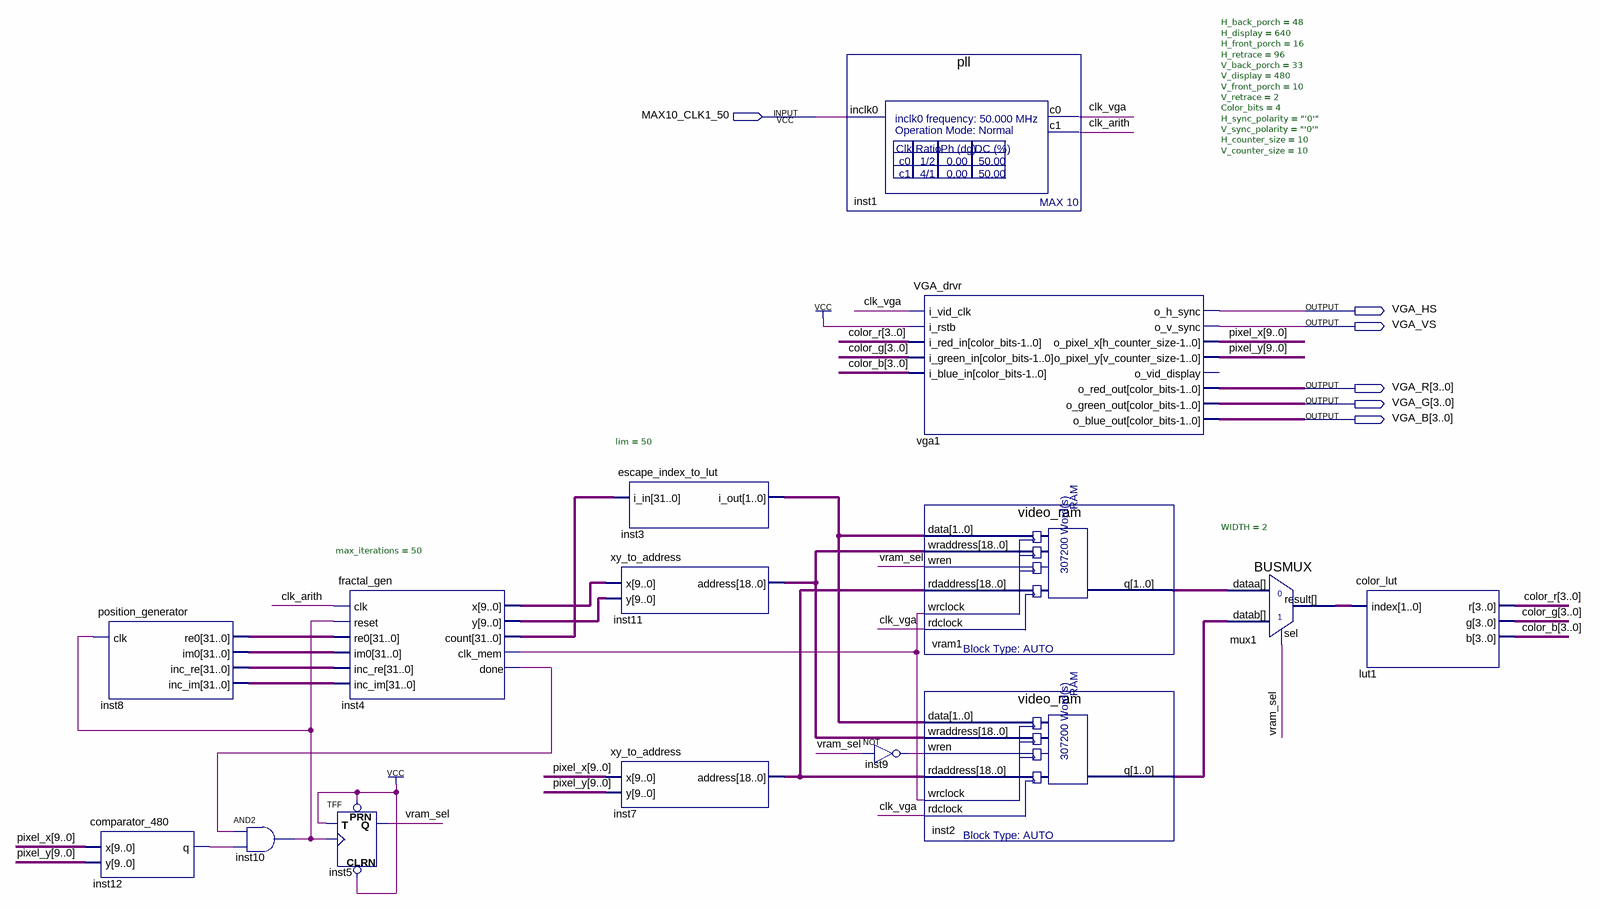
[diagram p0: schematic sheet]
// Quartus schematic fractal.bdf as structural Verilog: 15 symbols, 6 pins
module fractal (
  input  MAX10_CLK1_50,
  output VGA_HS,
  output VGA_VS,
  output [3:0] VGA_R,
  output [3:0] VGA_G,
  output [3:0] VGA_B
);

  wire clk_arith, clk_vga, inst4_clk_mem, inst4_done, inst9_out, inst10_out, inst12_q, vram_sel;
  wire [1:0] inst2_q, inst3_i_out, mux1_result, vram1_q;
  wire [3:0] color_b, color_g, color_r;
  wire [9:0] inst4_x, inst4_y, pixel_x, pixel_y;
  wire [18:0] inst7_address, inst11_address;
  wire [31:0] inst4_count, inst8_im0, inst8_inc_im, inst8_inc_re, inst8_re0;

  position_generator inst8 (
    .clk(inst10_out), .re0(inst8_re0), .im0(inst8_im0), .inc_re(inst8_inc_re), .inc_im(inst8_inc_im));
  comparator_480 inst12 (.x(pixel_x), .y(pixel_y), .q(inst12_q));
  and inst10 (inst10_out, inst4_done, inst12_q);
  fractal_gen #(.max_iterations(50)) inst4 (
    .clk(clk_arith), .reset(inst10_out), .re0(inst8_re0), .im0(inst8_im0), .inc_re(inst8_inc_re),
    .inc_im(inst8_inc_im), .x(inst4_x), .y(inst4_y), .count(inst4_count), .clk_mem(inst4_clk_mem),
    .done(inst4_done));
  TFF inst5 (.PRN(1'b1), .CLRN(1'b1), .T(1'b1), .CLK(inst10_out), .Q(vram_sel));
  escape_index_to_lut #(.lim(50)) inst3 (.i_in(inst4_count), .i_out(inst3_i_out));
  xy_to_address inst11 (.x(inst4_x), .y(inst4_y), .address(inst11_address));
  xy_to_address inst7 (.x(pixel_x), .y(pixel_y), .address(inst7_address));
  pll inst1 (.inclk0(MAX10_CLK1_50), .c0(clk_vga), .c1(clk_arith));
  not inst9 (inst9_out, vram_sel);
  VGA_drvr #(.H_back_porch(48), .H_display(640), .H_front_porch(16), .H_retrace(96), .V_back_porch(33), .V_display(480), .V_front_porch(10), .V_retrace(2), .Color_bits(4), .H_sync_polarity("'0'"), .V_sync_polarity("'0'"), .H_counter_size(10), .V_counter_size(10)) vga1 (
    .i_vid_clk(clk_vga), .i_rstb(1'b1), .i_red_in(color_r), .i_green_in(color_g), .i_blue_in(color_b),
    .o_h_sync(VGA_HS), .o_v_sync(VGA_VS), .o_pixel_x(pixel_x), .o_pixel_y(pixel_y), .o_red_out(VGA_R),
    .o_green_out(VGA_G), .o_blue_out(VGA_B));  // open: o_vid_display
  video_ram vram1 (
    .data(inst3_i_out), .wraddress(inst11_address), .wren(vram_sel), .rdaddress(inst7_address),
    .wrclock(inst4_clk_mem), .rdclock(clk_vga), .q(vram1_q));
  video_ram inst2 (
    .data(inst3_i_out), .wraddress(inst11_address), .wren(inst9_out), .rdaddress(inst7_address),
    .wrclock(inst4_clk_mem), .rdclock(clk_vga), .q(inst2_q));
  BUSMUX #(.WIDTH(2)) mux1 (.datab(inst2_q), .sel(vram_sel), .dataa(vram1_q), .result(mux1_result));
  color_lut lut1 (.index(mux1_result), .r(color_r), .g(color_g), .b(color_b));
endmodule
